# EasyEDA Pro project ProPrj_DiscoTech 6 Current_2026-05-06.epro, board Control_Auto_Mute
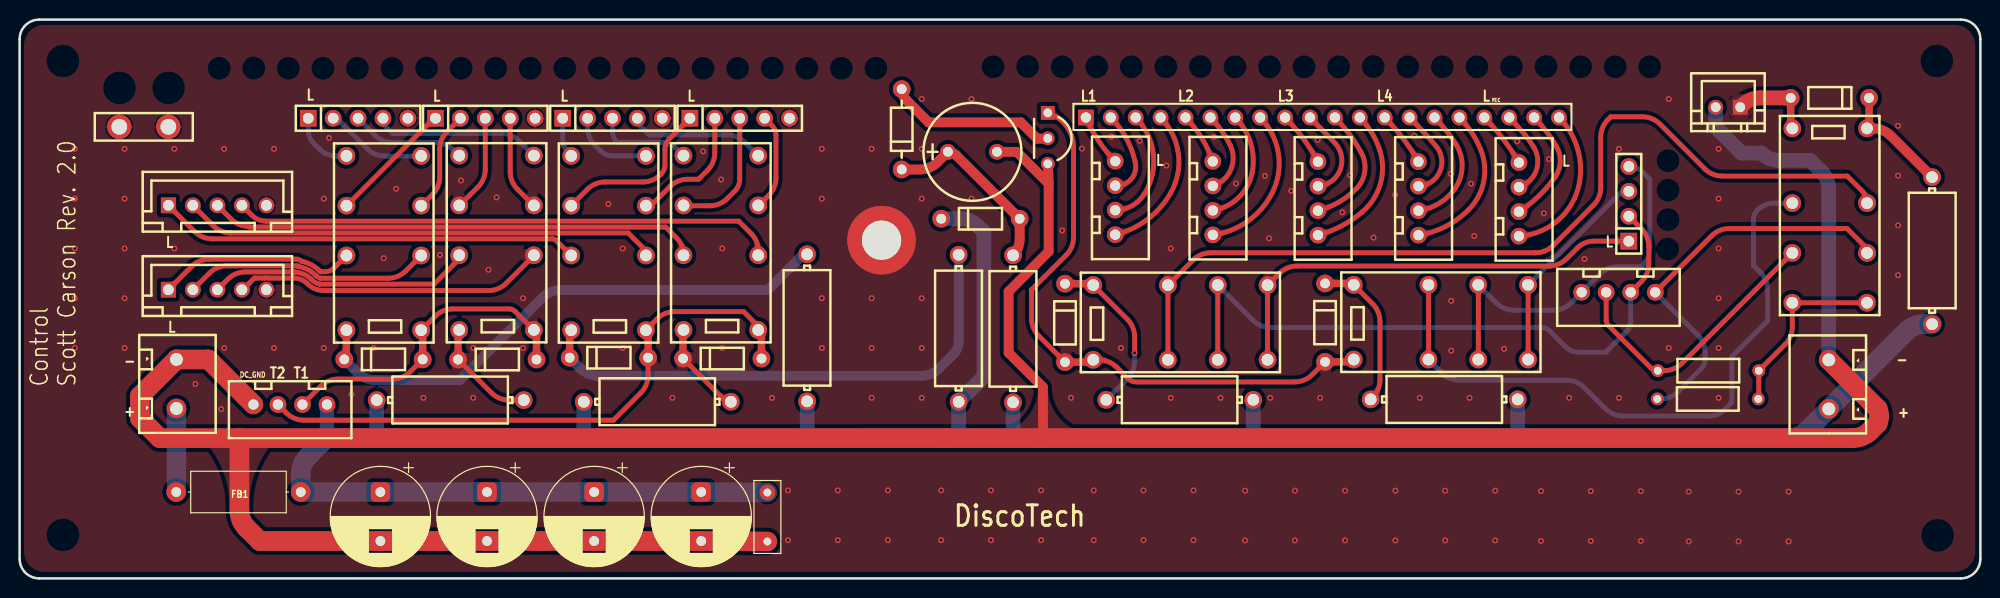
[diagram p14: board, top side]
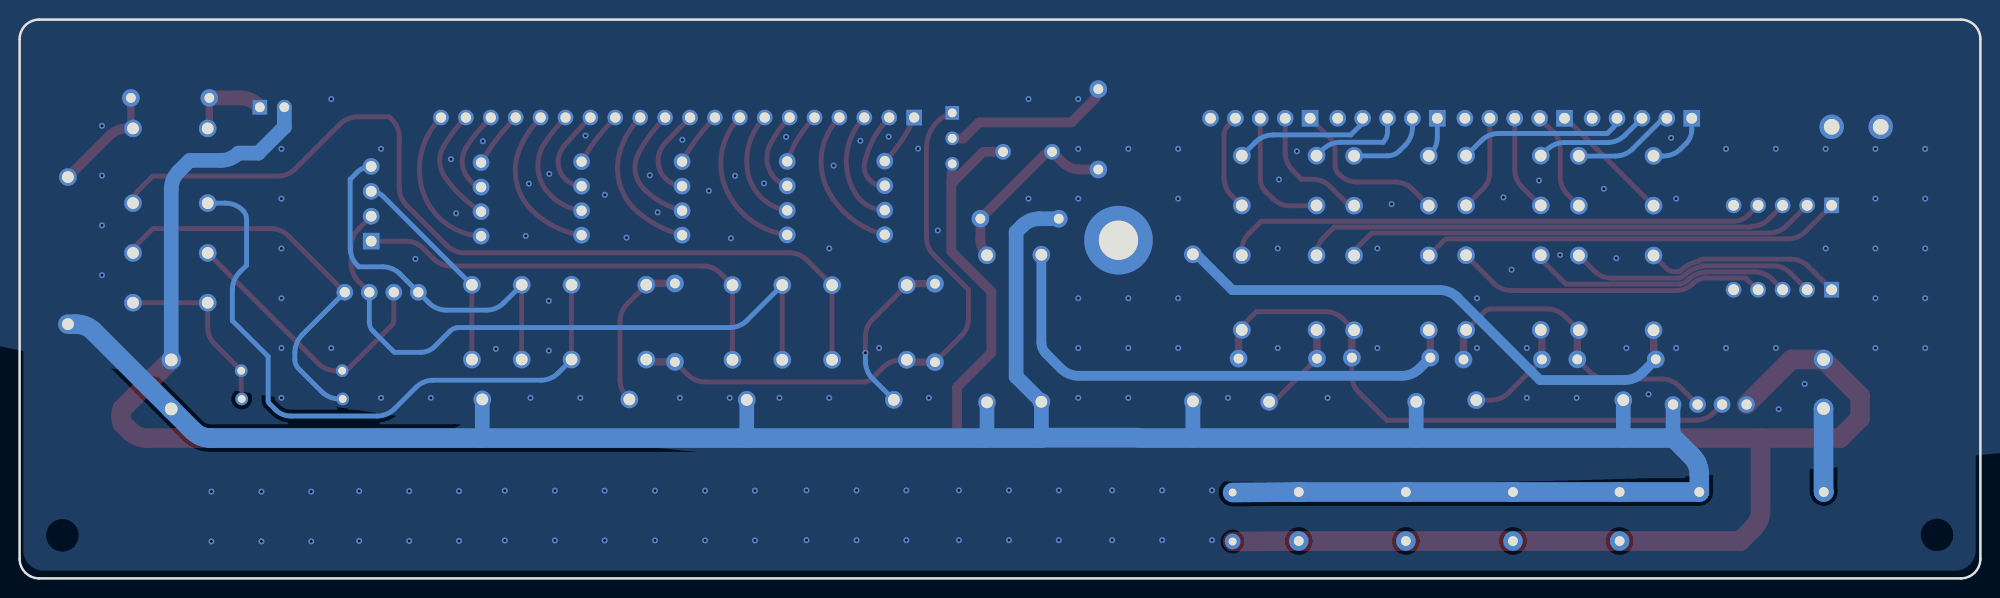
[diagram p15: board, bottom side, seen from below]

Outline 200 x 57 mm; copper layers: Top Layer, Bottom Layer. Coordinates in mm from the lower left corner of the outline.
Outline path: 0,55 0,2 arc(0.59,0.59) 2,0 198,0 arc(199.41,0.59) 200,2 200,55 arc(199.41,56.41) 198,57 2,57 arc(0.59,56.41) 0,55
Stack: Top Layer 0.035mm / Dielectric1 1.51mm FR4 er 4.5 / Bottom Layer 0.035mm

## Design rules (mm)
template: Custom Config
spacing copperThickness1oz (default): track to track 0.1, other pairs 0.152 to 0.3
spacing copperThickness2oz: track to track 0.203, other pairs 0.152 to 0.3
track width copperThickness1oz (default): min 0.127, default 0.254, max 2.54
track width copperThickness2oz: min 0.203, default 0.254, max 2.54
differential pair differentialPair (default): width min 0.127, default 0.254, max 2.54; gap min 0.152, default 0.152
via viaSize (default): diameter min 0.5, default 0.61, max 10; hole min 0.3, default 0.305, max 6.3
pour e120 uses copperRegion

## Placement (name value [footprint] x y rotation side)
C1  1000uF  [CAP-TH_BD10.0-P5.00-D0.6-FD_6]  97.19 43.51 0 top
C2  100uF  [Capacitor_THT:CP_Radial_D10.0mm_P5.00mm]  36.8 8.81 270 top
C3  100uF  [Capacitor_THT:CP_Radial_D10.0mm_P5.00mm]  47.68 8.81 270 top
C4  100uF  [Capacitor_THT:CP_Radial_D10.0mm_P5.00mm]  58.6 8.81 270 top
C5  100uF  [Capacitor_THT:CP_Radial_D10.0mm_P5.00mm]  69.53 8.81 270 top
C6  100nF  [Capacitor_THT:C_Rect_L7.2mm_W2.5mm_P5.00mm_FKS2_FKP2_MKS2_MKP2]  76.27 3.76 90 top
CN1  MONO_SW  [CONN-TH_2P-P2.50_HX-2.54MM-2P-ZZ-MS]  174.25 48.06 180 top
D1  1N4148  [DO-35_BD2.0-L4.0-P8.00-D0.5-FD]  106.63 26.06 90 top
D2  1N4148  [DO-35_BD2.0-L4.0-P8.00-D0.5-FD]  133.16 26.09 90 top
D3  1N4148  [DO-35_BD2.0-L4.0-P8.00-D0.5-FD]  37.11 22.34 180 top
D4  1N4148  [DO-35_BD2.0-L4.0-P8.00-D0.5-FD]  48.73 22.33 180 top
D5  1N4148  [DO-35_BD2.0-L4.0-P8.00-D0.5-FD]  60.11 22.51 180 top
D6  1N4148  [DO-35_BD2.0-L4.0-P8.00-D0.5-FD]  71.67 22.42 180 top
D7  1N4148  [DO-35_BD2.0-L4.0-P8.00-D0.5-FD]  98.01 36.69 180 top
D8  1N4148  [DO-35_BD2.0-L4.0-P8.00-D0.5-FD]  184.65 49.01 0 top
D9  1N5245B  [DO-35_BD2.0-L4.2-P8.20-D0.5-R-RD]  89.97 45.81 90 top
FB1  FerriteBead_Small  [Inductor_THT:L_Axial_L9.5mm_D4.0mm_P12.70mm_Horizontal_Fastron_SMCC]  15.97 8.81 0 top
H2  Line_Level  [HDR-TH_20P-P2.54-V-M_4]  132.89 47.01 0 top
K1  G5V-2-H1 DC24  [RELAY-TH_G5V-2]  118.4 26.11 0 top
K2  G5V-2-H1 DC24  [RELAY-TH_G5V-2]  144.97 26.14 0 top
K3  G5V-2-H1 DC24  [RELAY-TH_G5V-2]  37.15 34.21 90 top
K4  G5V-2-H1 DC24  [RELAY-TH_G5V-2]  48.65 34.24 90 top
K5  G5V-2-H1 DC24  [RELAY-TH_G5V-2]  60.08 34.21 90 top
K6  G5V-2-H1 DC24  [RELAY-TH_G5V-2]  71.52 34.23 90 top
K7  G5V-2-H1 DC24  [RELAY-TH_G5V-2]  184.62 37.01 270 top
NOREF  -  [Pad_e5956]  87.92 34.5 0 top
P1  40V_In  [CONN-TH_WJ126V-5.0-2P]  16 19.83 0 top
P2  PHONO_GND_POST  [HDR-TH_P5.00-V-M]  12.67 46.06 180 top
P3  40V_Out  [CONN-TH_WJ126V-5.0-2P]  184.54 19.79 180 top
Q1  BC546B  [TO-92-3_L4.8-W3.7-P2.60-L_LP0003A]  104.87 44.89 270 top
R1  2kΩ  [RES-TH_BD4.5-L11.5-P15.00-D0.8]  118.33 18.21 0 top
R2  2kΩ  [RES-TH_BD4.5-L11.5-P15.00-D0.8]  145.31 18.26 180 top
R3  2kΩ  [RES-TH_BD4.5-L11.5-P15.00-D0.8]  80.32 25.56 90 top
R4  2kΩ  [RES-TH_BD4.5-L11.5-P15.00-D0.8]  43.92 18.19 0 top
R5  2kΩ  [RES-TH_BD4.5-L11.5-P15.00-D0.8]  95.78 25.51 90 top
R6  2kΩ  [RES-TH_BD4.5-L11.5-P15.00-D0.8]  65.05 18.01 0 top
R7  10k  [RES-TH_BD4.5-L11.5-P15.00-D0.8]  101.33 25.46 90 top
R8  2kΩ  [RES-TH_BD4.5-L11.5-P15.00-D0.8]  195.07 33.44 270 top
R9  4.7kΩ  [RES-TH_BD2.4-L6.3-P10.30-D0.6]  172.25 21.19 0 top
R10  4.7kΩ  [RES-TH_BD2.4-L6.3-P10.30-D0.6]  172.19 18.31 180 top
U1  Master In  [CONN-TH_4P-P2.50-XH2.54-4P]  163.08 29.19 0 top
U2  Output  [HDR-TH_4P-P2.54-V-M]  164.14 38.21 90 top
U3  T1A_IN  [HDR-TH_5P-P2.54-V-M]  34.52 46.94 0 top
U4  T1B_IN  [HDR-TH_5P-P2.54-V-M]  47.5 46.94 0 top
U5  T2A_IN  [HDR-TH_5P-P2.54-V-M]  60.47 46.94 0 top
U6  T2B_IN  [HDR-TH_5P-P2.54-V-M]  73.45 46.94 0 top
U7  T1_OUT  [CONN-TH_5P-P2.50_ZX-XH2.54-5PZZ]  20.17 29.45 0 top
U8  T2_OUT  [CONN-TH_5P-P2.50_ZX-XH2.54-5PZZ]  20.17 38.05 0 top
U9  Selector  [CONN-TH_4P-P2.50-XH2.54-4P]  27.6 17.74 0 top
U10  Line_1  [CONN-TH_4P-P2.50-XH2.54-4P]  111.76 38.81 90 top
U11  Line_2  [CONN-TH_4P-P2.50-XH2.54-4P]  121.71 38.79 90 top
U12  Line_3  [CONN-TH_4P-P2.50-XH2.54-4P]  132.43 38.76 90 top
U13  Line_4  [CONN-TH_4P-P2.50-XH2.54-4P]  142.68 38.76 90 top
U14  Record  [CONN-TH_4P-P2.50-XH2.54-4P]  152.93 38.66 90 top

## Footprints (pads in the part's own frame, mm; a bottom-side part is the same pattern mirrored in y, then rotated)
CAP-TH_BD10.0-P5.00-D0.6-FD_6
  round 1.6 hole 1: 1(-2.5,0) 2(2.5,0)
Capacitor_THT:C_Rect_L7.2mm_W2.5mm_P5.00mm_FKS2_FKP2_MKS2_MKP2
  round 1.6 hole 0.8: 1(0,0) 2(5,0)
Capacitor_THT:CP_Radial_D10.0mm_P5.00mm
  rrect 2x2 hole 1: 1(0,0)
  round 2 hole 1: 2(5,0)
CONN-TH_2P-P2.50_HX-2.54MM-2P-ZZ-MS
  rect 1.5x1.5 hole 1: 1(-1.25,0)
  round 1.5 hole 1: 2(1.25,0)
CONN-TH_4P-P2.50-XH2.54-4P
  round 1.7 hole 1.05: 1(3.75,0) 2(1.25,0) 3(-1.25,0) 4(-3.75,0)
CONN-TH_5P-P2.50_ZX-XH2.54-5PZZ
  rect 1.524x1.6 hole 1.1: 1(-5,0)
  round 1.6 hole 1.1: 2(-2.5,0) 3(0,0) 4(2.5,0) 5(5,0)
CONN-TH_WJ126V-5.0-2P
  round 2 hole 1.3: 1(0,2.501) 2(0,-2.501)
DO-35_BD2.0-L4.0-P8.00-D0.5-FD
  round 1.8 hole 1: 1(-4,0) 2(4,0)
DO-35_BD2.0-L4.2-P8.20-D0.5-R-RD
  round 1.8 hole 1: 1(4.1,0) 2(-4.1,0)
HDR-TH_4P-P2.54-V-M
  rect 1.7x1.7 hole 1.1: 1(-3.81,0)
  round 1.7 hole 1.1: 2(-1.27,0) 3(1.27,0) 4(3.81,0)
HDR-TH_5P-P2.54-V-M
  rect 1.7x1.7 hole 1.1: 1(-5.08,0)
  round 1.7 hole 1.1: 2(-2.54,0) 3(0,0) 4(2.54,0) 5(5.08,0)
HDR-TH_20P-P2.54-V-M_4
  rect 1.6x1.6 hole 1.05: 1(-24.13,0)
  round 1.6 hole 1.05: 2(-21.59,0) 3(-19.05,0) 4(-16.51,0) 5(-13.97,0) 6(-11.43,0) 7(-8.89,0) 8(-6.35,0) 9(-3.81,0) 10(-1.27,0) 11(1.27,0) 12(3.81,0) 13(6.35,0) 14(8.89,0) 15(11.43,0) 16(13.97,0) 17(16.51,0) 18(19.05,0) 19(21.59,0) 20(24.13,0)
HDR-TH_P5.00-V-M
  round 2.5 hole 1.6: 1(-2.5,0) 2(2.5,0)
Inductor_THT:L_Axial_L9.5mm_D4.0mm_P12.70mm_Horizontal_Fastron_SMCC
  round 2 hole 1: 1(0,0) 2(12.7,0)
Pad_e5956
  round 7 hole 4: 1(0,0)
RELAY-TH_G5V-2
  round 1.8 hole 1.2: 1(-8.89,-3.81) 4(-1.27,-3.81) 6(3.81,-3.81) 8(8.89,-3.81) 9(8.89,3.81) 11(3.81,3.81) 13(-1.27,3.81) 16(-8.89,3.81)
RES-TH_BD2.4-L6.3-P10.30-D0.6
  round 1.3 hole 0.8: 1(-5.15,0) 2(5.15,0)
RES-TH_BD4.5-L11.5-P15.00-D0.8
  round 1.8 hole 1.2: 1(-7.5,0) 2(7.5,0)
TO-92-3_L4.8-W3.7-P2.60-L_LP0003A
  rect 1.4x1.4 hole 0.9: 1(-2.6,0)
  round 1.4 hole 0.9: 2(0,0) 3(2.6,0)

## Nets
As in the schematic, except:
CHASSIS_GND: NOREF.1 P2.1 P2.2 U3.5 U4.5 U5.5 U6.5 U7.5 U8.5

## Via types
v1: diameter 0.61, hole 0.305, Top Layer to Bottom Layer, 152 vias

## Routing (per net, layer and track width the routed paths; a pad name or vN(x,y) marks a point on that pad's centre or on a via; arc(x,y) is an arc through that point)
40V: length 8.5
  Bottom Layer w2: P1.2 16,8.87 arc(15.99,8.84) FB1.1
CHASSIS_GND:
  vias: v1(5.63,43.82) v1(5.63,38.74) v1(5.63,33.66) v1(5.63,28.58) v1(5.63,23.5) v1(10.71,43.82) v1(10.71,38.74) v1(10.71,33.66) v1(10.71,28.58) v1(10.71,23.5) v1(15.79,43.82) v1(15.79,33.66) v1(17.93,19.83) v1(20.57,17.26) v1(20.87,43.82) v1(20.87,23.5) v1(25.95,43.82) v1(25.95,23.5) v1(31.03,38.74) v1(31.03,23.5) v1(31.55,44.94) v1(33.85,18.78) v1(36.11,23.5) v1(37.14,32.66) v1(38.41,39.75) v1(41.19,18.42) v1(42.87,32.99) v1(45.02,40.59) v1(46.27,23.5) v1(46.27,18.42) v1(47.82,31.49) v1(48.65,38.86) v1(51.35,28.58) v1(51.35,23.5) v1(60.06,38.18) v1(61.51,33.66) v1(61.51,23.5) v1(66.59,18.42) v1(69.72,43.56) v1(71.55,40.69) v1(71.67,33.66) v1(71.67,23.5) v1(76.75,18.42) v1(78.38,8.98) v1(78.38,3.9) v1(81.83,43.82) v1(81.83,38.74) v1(81.83,28.58) v1(81.83,23.5) v1(83.46,8.98) v1(83.46,3.9) v1(86.91,43.82) v1(86.91,28.58) v1(86.91,23.5) v1(86.91,18.42) v1(88.56,8.98) v1(88.56,3.9) v1(92.01,48.9) v1(92.01,43.82) v1(92.01,38.74) v1(92.01,28.58) v1(92.01,23.5) v1(92.01,18.42) v1(94,8.98) v1(94,3.9) v1(97.09,48.9) v1(97.09,38.74) v1(99.08,8.98) v1(99.08,3.9) v1(104.19,8.98) v1(104.19,3.9) v1(106.35,35.49) v1(107.25,18.42) v1(108.35,43.84) v1(109.55,8.98) v1(109.55,3.9) v1(111.36,45.06) v1(112.33,23.5) v1(114.25,44.64) v1(114.63,8.98) v1(114.63,3.9) v1(116.97,42.11) v1(117.41,33.66) v1(117.41,18.42) v1(119.74,8.98) v1(119.74,3.9) v1(121.82,45.04) v1(122.49,18.42) v1(124.07,40.29) v1(125,8.95) v1(125,3.87) v1(127.02,41.06) v1(127.45,34.69) v1(127.57,18.42) v1(129.7,39.54) v1(130.08,8.95) v1(130.08,3.87) v1(132.4,44.74) v1(132.65,18.42) v1(134.92,37.34) v1(135.19,8.95) v1(135.19,3.87) v1(135.72,41.11) v1(138.1,34.76) v1(140.31,39.13) v1(140.33,8.95) v1(140.33,3.87) v1(142.27,45.16) v1(142.81,18.42) v1(145.41,8.95) v1(145.41,3.87) v1(145.97,41.26) v1(146.02,28.31) v1(146.02,23.23) v1(147.89,18.42) v1(148.05,40.26) v1(148.37,34.94) v1(150.51,8.95) v1(150.51,3.87) v1(151.42,23.41) v1(152.75,44.59) v1(155.18,8.9) v1(155.18,3.82) v1(155.47,37.24) v1(156,42.76) v1(158.05,18.42) v1(159.62,32.59) v1(160.26,8.9) v1(160.26,3.82) v1(163.13,43.82) v1(163.13,18.42) v1(165.36,8.9) v1(165.36,3.82) v1(168.21,48.9) v1(168.21,23.5) v1(170.25,8.85) v1(170.25,3.77) v1(173.29,43.82) v1(173.29,38.74) v1(173.29,33.66) v1(173.29,28.58) v1(173.29,23.5) v1(173.29,18.42) v1(175.33,8.85) v1(175.33,3.77) v1(180.44,8.85) v1(180.44,3.77) v1(191.6,46.17) v1(191.6,41.09) v1(191.6,36.01) v1(191.6,30.93)
DC_GND: length 339.3
  Top Layer w1: 104.25,14.31 104.38,14.44 104.38,19.51 100.88,23.01 100.88,29.26 104.96,33.34 104.96,40.26 ; 104.96,40.26 101.71,43.51 C1.2 ; 104.96,40.26 arc(104.94,41.28) Q1.3
  Top Layer w2: 69.52,3.81 C4.2 C3.2 C2.2 24.5,3.81 23.17,5.14 arc(22.87,5.5) 22.64,5.91 arc(22.48,6.41) 22.42,6.94 22.42,14.31 ; 22.42,14.31 94.3,14.31 ; 22.42,14.31 14.3,14.31 12.27,16.34 12.27,18.61 P1.1 19.25,22.33 U9.4 ; 94.32,14.31 186.97,14.31 arc(187.94,14.51) 188.77,15.06 189.52,15.81 arc(189.67,16.56) 189.52,17.3 P3.2 ; C5.2 C6.1
  Bottom Layer w1.5: P3.2 184.54,39.7 arc(184.34,40.67) 183.79,41.49 182.65,42.64 179.48,42.64 arc(178.5,42.83) 177.68,43.38 175.65,43.38 173,46.03 CN1.2
L_GND: length 66.1
  Top Layer w0.5: U2.2 165.44,35.64 arc(165.99,34.82) 166.18,33.85 166.18,32.09 arc(165.99,31.12) 165.44,30.29 U1.2 ; 122.21,29.91 122.21,22.29
  Bottom Layer w0.5: 122.21,29.91 125.79,26.33 arc(126.61,25.78) 127.59,25.59 155.23,25.59 arc(155.69,25.5) 156.08,25.23 157.68,23.64 arc(158.32,23.21) 159.07,23.06 161.78,23.06 163.96,25.24 arc(164.23,25.65) 164.33,26.14 U1.2
R_GND: length 38.6
  Top Layer w0.5: 148.79,29.92 148.79,22.3
  Bottom Layer w0.5: 148.79,29.92 150.61,28.11 arc(151.43,27.56) 152.41,27.36 156.45,27.36 arc(157.43,27.56) 158.25,28.11 U1.4 161.19,31.04 arc(162.01,31.59) 162.98,31.79 165.41,31.79 165.54,31.92 arc(166.09,32.74) 166.28,33.71 166.28,40.71 165.56,41.43 arc(164.91,41.87) U2.4
VDC: length 275.7
  Bottom Layer w1.5: R6.1 57.55,14.31 ; 153.01,14.06 152.81,14.26 R2.1 ; D7.2 95.95,36.69 arc(96.92,36.49) 97.75,35.94 98.36,35.34 98.36,20.59 R5.1 95.78,14.33 95.77,14.31 ; R3.1 80.32,14.31 ; R4.1 36.42,14.31 ; 31.35,14.37 U9.1 ; R7.1 101.33,14.42 101.44,14.31 ; R1.2 125.83,14.31
  Bottom Layer w2: 86.02,14.36 95.62,14.36 ; 85.81,14.31 31.35,14.31 ; C6.2 C5.1 arc(69.52,8.81) 69.52,8.81 C4.1 C3.1 C2.1 FB1.2 28.67,10.64 arc(28.75,11.25) 28.97,11.83 arc(29.17,12.15) 29.42,12.44 31.35,14.37 ; R8.2 194.24,25.94 arc(193.27,25.74) 192.44,25.19 P3.1 182.31,15.06 arc(181.48,14.51) 180.51,14.31 95.77,14.31 arc(95.71,14.35) 95.65,14.36
$1N1234: length 60.7
  Top Layer w0.5: D2.1 131.85,20.78 arc(131.03,20.23) 130.05,20.04 113.9,20.04 arc(113.44,20.13) 113.06,20.39 111.9,21.54 arc(111.07,22.09) 110.1,22.29 109.51,22.29 ; D1.1 103.96,24.73 arc(103.41,25.55) 103.22,26.53 103.22,29.45 106.76,32.99 arc(107.31,33.81) 107.5,34.78 107.5,43.93 arc(106.77,46.14) Q1.1
  Top Layer w0.75: D1.1 108.97,22.06 arc(109.26,22.12) 109.51,22.29 ; D2.1 135.57,22.09 arc(135.85,22.14) 136.09,22.3
$1N1275: length 61.5
  Top Layer w0.5: D5.1 64.11,20.72 arc(63.91,19.75) 63.36,18.93 60.57,16.14 29,16.14 arc(28.03,16.33) 27.2,16.88 U9.3 ; 63.87,25.32 65.01,26.47 arc(65.84,27.02) 66.81,27.21 73.85,27.21 75.08,25.98 arc(75.28,25.67) 75.36,25.31
  Top Layer w0.75: D5.1 64.11,24.74 arc(64.05,25.06) 63.87,25.32 ; D6.1 75.67,24.55 arc(75.59,24.96) 75.36,25.31
$1N1926: length 9.6
  Top Layer w0.5: 67.67,22.42 71.75,18.34 arc(72.12,18.1) R6.2
  Top Layer w0.75: 67.67,22.42 67.67,25.15 arc(67.69,25.24) 67.74,25.31
$1N1928: length 11.3
  Top Layer w0.5: R4.2 49.92,18.19 arc(48.95,18.38) 48.12,18.93 D4.2
  Top Layer w0.75: D4.2 44.73,25.04 arc(44.76,25.19) 44.84,25.31
$1N1930: length 15.9
  Top Layer w0.5: R2.2 138.01,18.47 arc(138.56,19.29) 138.76,20.26 138.76,26.21 arc(138.56,27.18) 138.01,28 136.09,29.92
  Top Layer w0.75: D2.2 135.7,30.09 arc(135.91,30.04) 136.09,29.92
$1N1932: length 17.3
  Top Layer w0.5: v1(113.73,23.01) 113.73,24.64 arc(113.54,25.61) 112.99,26.43 109.51,29.91
  Top Layer w0.75: D1.2 109.14,30.06 arc(109.34,30.02) 109.51,29.91
  Bottom Layer w0.5: v1(113.73,23.01) 113.73,22.16 arc(113.54,21.19) 112.99,20.37 R1.1
$1N1934: length 56.2
  Top Layer w0.75: 33.33,25.3 33.33,22.86 arc(33.27,22.58) D3.2
  Bottom Layer w1: D3.2 34.47,20.98 arc(35.3,20.43) 36.27,20.24 44.92,20.24 53.35,28.67 arc(54.18,29.22) 55.15,29.41 76.3,29.41 79.68,32.8 arc(79.98,32.99) R3.2
$1N1936: length 53.7
  Top Layer w0.75: 56.11,22.51 56.11,24.98 arc(56.14,25.17) 56.25,25.32
  Bottom Layer w1: R5.2 95.78,24.08 arc(95.66,23.46) 95.31,22.94 93.77,21.41 arc(92.95,20.86) 91.98,20.66 ; 91.95,20.66 59.01,20.66 arc(58.04,20.86) 57.21,21.41 56.11,22.51
$1N2059: length 19.3
  Top Layer w1: D9.2 91.84,41.71 arc(92.81,41.91) 93.63,42.46 C1.1 arc(95.14,43.42) 95.53,43.17 D7.1 102.01,34.59 arc(101.83,33.71) R7.2
$1N2091: length 28.9
  Top Layer w0.5: 180.82,33.2 169.55,21.93 arc(168.73,21.38) 167.75,21.19 R9.1 arc(166.71,21.27) 166.37,21.49 162.05,25.81 arc(161.89,26.05) 161.83,26.34 U1.3
$1N2125: length 46
  Top Layer w0.5: 127.29,22.29 127.29,29.91 128.5,31.12 arc(129.33,31.67) 130.3,31.86 156,31.86 arc(156.97,32.06) 157.79,32.61 158.9,33.71 arc(159.66,34.22) 160.56,34.4 U2.1
$1N2148: length 21.8
  Top Layer w0.5: 153.87,29.92 153.87,22.3
  Bottom Layer w0.5: 153.87,29.92 162.93,38.98 arc(163.48,39.35) U2.3
$1N2227: length 20.3
  Top Layer w0.5: 33.33,32.92 32.05,31.64 arc(31.65,31.38) 31.19,31.28 30.69,31.28 arc(30.66,31.31) 30.63,31.34 arc(29.75,31.99) 28.72,32.36 arc(28.51,32.51) 28.25,32.56 19.34,32.56 arc(18.37,32.37) 17.54,31.82 U7.1
$1N2231: length 43.1
  Top Layer w0.5: U8.1 17.85,35.38 arc(18.67,34.83) 19.64,34.64 54.38,34.64 arc(54.54,34.6) 54.68,34.51 56.25,32.94
$1N2236: length 27
  Top Layer w0.5: U7.3 21.24,30.52 arc(22.07,31.07) 23.04,31.26 28.05,31.26 arc(28.07,31.26) 28.08,31.25 28.1,31.24 arc(29.01,31.02) 29.77,30.49 arc(30.15,30.2) 30.6,30.02 42.27,30.02 44.59,32.34 arc(44.78,32.61) 44.84,32.93
$1N2241: length 50.1
  Top Layer w0.5: U8.3 21.57,36.66 arc(22.39,36.11) 23.37,35.91 23.44,35.84 65.9,35.84 66.99,34.74 arc(67.54,33.92) 67.74,32.95 67.74,32.93
$1N2971: length 33.2
  Top Layer w0.5: D3.1 39.85,21.08 arc(39.03,20.53) 38.06,20.34 32.5,20.34 arc(31.53,20.14) 30.7,19.59 U9.2 ; 40.95,25.3 42.39,26.74 arc(43.21,27.29) 44.19,27.49 49.95,27.49 arc(50.26,27.42) 50.53,27.25 52.46,25.31
  Top Layer w0.75: D4.1 52.73,24.67 arc(52.66,25.02) 52.46,25.31 ; D3.1 41.11,24.9 arc(41.07,25.12) 40.95,25.3
$1N3037: length 10.4
  Bottom Layer w0.5: 40.95,43.08 37.26,43.08 arc(36.28,43.28) 35.46,43.83 32.61,46.68 arc(32.32,46.87) U3.2
$1N3042: length 17.2
  Bottom Layer w0.5: 52.46,43.09 50.91,44.64 arc(50.09,45.19) 49.12,45.39 38.05,45.39 37.47,45.97 arc(37.17,46.41) U3.4
$1N3056: length 10.4
  Top Layer w0.5: 40.95,38 42.1,39.16 arc(42.66,39.98) 42.85,40.95 42.85,43.77 arc(43.04,44.75) 43.59,45.57 U4.2
$1N3362: length 25.4
  Top Layer w0.5: U7.2 19.37,31.14 arc(20.19,31.69) 21.16,31.89 28.31,31.89 arc(28.37,31.88) 28.41,31.84 28.46,31.8 arc(29.4,31.5) 30.2,30.91 arc(30.42,30.74) 30.68,30.62 37.6,30.62 arc(38.57,30.82) 39.39,31.37 40.95,32.92
$1N3371: length 32
  Top Layer w0.5: 52.46,32.93 49.63,30.11 arc(48.81,29.56) 47.84,29.36 31.04,29.36 arc(30.12,29.54) 29.35,30.06 arc(28.71,30.49) 27.96,30.64 25.35,30.64 arc(25.17,30.65) 24.99,30.64 23.95,30.64 22.82,29.51 arc(22.75,29.46) U7.4
$1N3379: length 48.4
  Top Layer w0.5: U8.2 19.75,35.98 arc(20.57,35.43) 21.54,35.24 62.07,35.24 63.51,33.8 arc(63.78,33.4) 63.87,32.94
$1N3391: length 55.5
  Top Layer w0.5: U8.4 23.68,37.05 arc(24.35,36.6) 25.15,36.44 73.35,36.44 74.61,35.18 arc(75.16,34.35) 75.36,33.38 75.36,32.93
$1N3414: length 6.5
  Bottom Layer w0.5: 33.33,43.08 32.36,43.08 arc(31.38,43.28) 30.56,43.83 30.02,44.36 arc(29.6,45) 29.44,45.76 U3.1
$1N3441: length 12.8
  Top Layer w0.5: 33.33,38 42.15,46.83 arc(42.28,46.91) U4.1
$1N3467: length 11.7
  Bottom Layer w0.5: U3.3 36.26,45.21 arc(37.08,44.66) 38.05,44.46 42.42,44.46 arc(43.39,44.27) 44.22,43.72 44.84,43.09
$1N3491: length 9.9
  Top Layer w0.5: 44.84,38.01 46.76,39.93 arc(47.31,40.75) 47.5,41.73 U4.3
$1N3506: length 9.8
  Top Layer w0.5: 52.46,38.01 50.78,39.69 arc(50.23,40.52) 50.04,41.49 U4.4
$1N3510: length 4.1
  Bottom Layer w0.5: 56.25,43.1 56.14,43.21 arc(55.59,44.04) 55.39,45.01 U5.1
$1N3516: length 8.5
  Bottom Layer w0.5: 63.87,43.1 60.48,43.1 arc(59.81,43.23) 59.25,43.61 58.68,44.18 arc(58.13,45.01) 57.93,45.98 U5.2
$1N3524: length 17.1
  Top Layer w0.5: 56.25,38.02 57.92,39.69 arc(58.74,40.24) 59.72,40.44 63.57,40.44 arc(64.54,40.63) 65.37,41.18 65.47,41.29 arc(65.73,41.67) 65.82,42.13 65.82,43.76 arc(65.94,44.34) 66.27,44.84 U6.1
$1N3533: length 13.1
  Top Layer w0.5: U6.2 70.91,43.43 arc(70.72,42.45) 70.17,41.63 69.25,40.71 68.13,40.71 arc(67.15,40.52) 66.33,39.97 64.75,38.39 arc(64.34,38.12) 63.87,38.02
$1N3544: length 9.9
  Bottom Layer w0.5: U5.3 60.47,45.57 arc(60.59,44.98) 60.92,44.49 65.29,44.49 arc(66.26,44.29) 67.08,43.74 67.74,43.09
$1N3551: length 14.1
  Bottom Layer w0.5: 75.36,43.09 73.95,44.49 arc(73.13,45.04) 72.16,45.24 64.22,45.24 63.36,46.1 arc(63.1,46.48) 63.01,46.94
$1N3558: length 13.3
  Top Layer w0.5: U6.3 73.45,40.72 arc(73.32,40.07) 72.95,39.51 72.19,38.75 arc(71.37,38.2) 70.39,38.01 67.74,38.01
$1N3565: length 10
  Top Layer w0.5: 75.36,38.01 76.4,39.06 arc(76.96,39.88) 77.15,40.85 77.15,45.26 arc(77.05,45.74) 76.78,46.14 U6.4
$1N6919: length 11.8
  Top Layer w0.75: D8.2 188.65,46.41 arc(188.59,46.13) 188.44,45.9
  Top Layer w1: 188.44,45.9 189.06,45.9 arc(190.03,45.71) 190.86,45.15 R8.1
$1N7000: length 8.6
  Top Layer w0.75: D8.1 180.65,46.31 arc(180.69,46.09) 180.82,45.9
  Top Layer w1.5: D8.1 177.5,49.01 arc(176.53,48.82) 175.7,48.27 CN1.1
$1N7087: length 41
  Top Layer w0.5: U1.1 172.59,34.94 arc(173.41,35.49) 174.38,35.69 186.4,35.69 188.12,33.97 arc(188.35,33.61) 188.44,33.2
  Bottom Layer w0.5: R10.2 167.39,18.31 arc(168.36,18.5) 169.19,19.05 171.57,21.43 arc(171.83,21.83) 171.92,22.29 171.92,23.04 arc(171.73,24.01) 171.18,24.84 U1.1
$1N7239: length 18.8
  Top Layer w0.5: 188.44,28.12 180.82,28.12 180.82,25.66 arc(180.62,24.69) 180.07,23.86 R9.2 177.4,18.44 arc(177.38,18.37) R10.1
$1N7333: length 66.5
  Top Layer w0.5: 143.71,29.92 143.71,22.3
  Bottom Layer w0.5: 143.71,22.3 145.06,20.96 arc(145.88,20.41) 146.86,20.21 157.8,20.21 arc(158.77,20.02) 159.59,19.47 161.75,17.31 arc(162.58,16.76) 163.55,16.56 172.35,16.56 arc(173.18,16.73) 173.88,17.2 174.52,17.84 arc(174.62,17.98) 174.65,18.14 174.65,22.64 178.3,26.29 178.3,29.44 arc(178.11,30.41) 177.55,31.23 176.85,31.94 176.85,36.63 arc(176.95,37.12) 177.22,37.54 arc(178.04,38.09) 179.01,38.28 180.82,38.28
$1N9047: length 17.3
  Top Layer w1: Q1.2 arc(104.85,44.87) 104.81,44.86 103.78,44.86 102.13,46.52 92.72,46.52 90.43,48.8 arc(90.09,49.31) D9.1
$1N11828: length 93.6
  Top Layer w0.5: 117.13,22.29 117.13,29.91 119.69,32.47 arc(120.52,33.02) 121.49,33.21 154.62,33.21 arc(155.59,33.41) 156.42,33.96 160.53,38.07 arc(161.08,38.89) 161.27,39.86 161.27,45.01 arc(161.47,45.98) 162.02,46.81 162.3,47.09 165.52,47.09 arc(166.49,46.89) 167.32,46.34 171.88,41.78 arc(172.7,41.23) 173.68,41.04 186.42,41.04 187.91,39.55 arc(188.3,38.97) 188.44,38.28
$2N368: length 5.4
  Top Layer w0.5: U10.1 arc(110.04,44.64) H2.1
$2N370: length 8.9
  Top Layer w0.5: H2.2 arc(112.88,44.89) 113.81,42.41 arc(113.37,40.72) U10.2
$2N372: length 12
  Top Layer w0.5: H2.3 arc(115.65,43.25) 114.71,39.19 arc(113.44,38) U10.3
$2N374: length 15.6
  Top Layer w0.5: H2.4 arc(118.2,43.34) 117.41,39.31 arc(115.02,36.61) U10.4
$2N376: length 5.3
  Top Layer w0.5: H2.5 arc(120.57,44.93) U11.1
$2N378: length 8.6
  Top Layer w0.5: U11.2 arc(123.55,41.7) 123.48,44.19 arc(122.59,45.68) H2.6
$2N380: length 12.1
  Top Layer w0.5: H2.7 arc(125.55,44.44) 125.73,41.44 arc(124.34,38.84) U11.3
$2N382: length 16
  Top Layer w0.5: H2.8 arc(128.4,43.36) 127.76,39.31 arc(125.26,36.43) U11.4
$2N384: length 5.6
  Top Layer w0.5: H2.9 arc(130.92,44.88) U12.1
$2N386: length 9.5
  Top Layer w0.5: H2.10 arc(132.9,45.72) 134.16,44.41 arc(134.69,41.66) U12.2
$2N388: length 13
  Top Layer w0.5: H2.11 arc(135.64,45.31) 136.86,43.41 arc(137.2,41.49) 136.33,39.74 arc(134.53,38.36) U12.3
$2N390: length 16
  Top Layer w0.5: U12.4 arc(134.81,35.94) 136.93,37.36 arc(138.79,40.21) 138.76,43.61 arc(137.93,45.44) H2.12
$2N392: length 5.7
  Top Layer w0.5: H2.13 arc(141.11,44.88) 142.68,42.51
$2N394: length 9.5
  Top Layer w0.5: H2.14 arc(143.16,45.58) 144.48,44.09 arc(144.86,41.48) 142.68,40.01
$2N396: length 12.8
  Top Layer w0.5: H2.15 arc(145.47,45.73) 146.48,44.34 arc(147.14,41.93) 146.28,39.59 arc(144.69,38.19) 142.68,37.51
$2N398: length 16.4
  Top Layer w0.5: H2.16 arc(148.11,45.48) 149.03,43.74 arc(149.34,40.49) 147.81,37.61 arc(145.45,35.9) 142.68,35.01
$2N400: length 5.8
  Top Layer w0.5: H2.17 arc(151.32,44.83) U14.1
$2N402: length 8.9
  Top Layer w0.5: U14.2 arc(154.68,41.57) 154.46,43.96 arc(154.02,44.63) 153.53,45.26 arc(152.76,46.16) H2.18
$2N404: length 12.2
  Top Layer w0.5: U14.3 arc(154.96,39) 156.63,40.96 arc(157.15,42.49) 156.76,44.06 arc(155.71,45.61) H2.19
$2N406: length 16.1
  Top Layer w0.5: H2.20 arc(158.87,43.95) 159.11,40.39 arc(156.97,36.57) U14.4

## Copper pours and planes (outline as drawn; the poured copper is in the pictures)
CHASSIS_GND on Top Layer: 0.55,54.36 0.57,54.65 0.63,54.93 0.73,55.19 0.87,55.44 1.04,55.67 1.24,55.87 1.47,56.04 1.72,56.18 1.99,56.28 2.26,56.34 2.55,56.36 197.37,56.36 197.66,56.34 197.94,56.28 198.2,56.18 198.45,56.04 198.68,55.87 198.88,55.67 199.06,55.44 199.19,55.19 199.29,54.93 199.35,54.65 199.37,54.36 199.37,2.76 199.35,2.48 199.29,2.2 199.19,1.93 199.06,1.68 198.88,1.45 198.68,1.25 198.45,1.08 198.2,0.94 197.94,0.84 197.66,0.78 197.37,0.76 2.55,0.76 2.26,0.78 1.99,0.84 1.72,0.94 1.47,1.08 1.24,1.25 1.04,1.45 0.87,1.68 0.73,1.93 0.63,2.2 0.57,2.48 0.55,2.76
CHASSIS_GND on Bottom Layer: 0.57,54.21 0.59,54.5 0.65,54.78 0.75,55.04 0.89,55.29 1.06,55.52 1.26,55.72 1.49,55.89 1.74,56.03 2.01,56.13 2.29,56.19 2.57,56.21 197.52,56.21 197.81,56.19 198.09,56.13 198.35,56.03 198.6,55.89 198.83,55.72 199.03,55.52 199.21,55.29 199.34,55.04 199.44,54.78 199.5,54.5 199.52,54.21 199.52,2.89 199.5,2.6 199.44,2.32 199.34,2.06 199.21,1.81 199.03,1.58 198.83,1.38 198.6,1.2 198.35,1.07 198.09,0.97 197.81,0.91 197.52,0.89 2.57,0.89 2.29,0.91 2.01,0.97 1.74,1.07 1.49,1.2 1.26,1.38 1.06,1.58 0.89,1.81 0.75,2.06 0.65,2.32 0.59,2.6 0.57,2.89

Small or netless copper shapes (teardrops, artwork), in the pictures only: 165 on Top Layer, 58 on Bottom Layer

## Text on the board
Top Silkscreen Layer: REC | DC_GND | - | + | L | T2 | T1 | L1 | L2 | L3 | L4 | Control / Scott Carson Rev. 2.0 | DiscoTech
